# EAGLE design monostable (EAGLE 7.5.0)
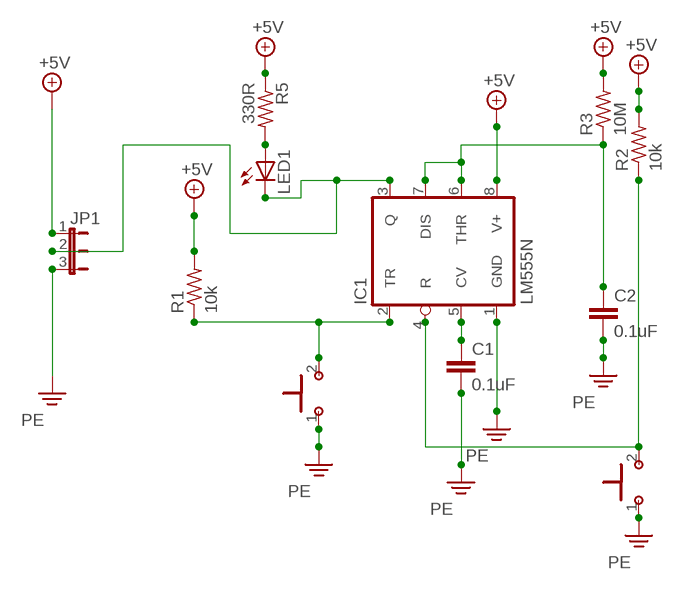
[diagram p0: schematic, sheet 1]

## Parts
C1  0.1uF  C-EU075-032X103  [C075-032X103]
C2  0.1uF  C-EU075-032X103  [C075-032X103]
IC1  LM555N  [DIL08]
JP1  JP2E  [JP2]
LED1  LED5MM  [LED5MM]
R1  10k  R-US_0207/10  [0207/10]
R2  10k  R-US_0207/10  [0207/10]
R3  10M  R-US_0207/10  [0207/10]
R5  330R  R-US_0207/10  [0207/10]
U$1  PUSHBUTTON  [PUSHBUTTON]
U$2  PUSHBUTTON  [PUSHBUTTON]

## Nets
+5V: IC1.8(V+) JP1.1 R1.2 R2.2 R3.2 R5.1
N$1: IC1.2(TR) R1.1 U$1.2
N$2: IC1.4(R) R2.1 U$2.2
N$3: C1.1 IC1.5(CV)
N$4: C2.1 IC1.6(THR) IC1.7(DIS) R3.1
N$5: IC1.3(Q) JP1.2 LED1.K(C)
N$6: LED1.A R5.2
PE: C1.2 C2.2 IC1.1(GND) JP1.3 U$1.1 U$2.1

## Library data of the parts
C1 C2 = rcl:C-EU: CAPACITOR, European symbol
IC1 = linear:*555: TIMER
JP1 = jumper:JP2E: JUMPER
LED1 = led:LED: LED OSRAM: - CHIPLED LG R971, LG N971, LY N971, LG Q971, LY Q971, LO R971, LY R971 LH N974, LH R974 LS Q976, LO Q976, LY Q976 LO Q996 - Hyper CHIPLED LW Q18S LB Q993, LB Q99A, LB R99A - SideLED LS A670, LO A670, LY A670, LG A670, LP A670 LB A673, LV A673, LT A673, LW A673 LH A674 LY A675 LS A676, LA A676, LO A676, LY A676, LW A676 LS A679, LY A679, LG A679 - Hyper Micro SIDELED® LS Y876, LA Y876, LO Y876, LY Y876 LT Y87S - SmartLED LW L88C, LW L88S LB L89C, LB L89S, LG L890 LS L89K, LO L89K, LY L89K LS L896, LA L896, LO L896, LY L896 - TOPLED LS T670, LO T670, LY T670, LG T670, LP T670 LSG T670, LSP T670, LSY T670, LOP T670, LYG T670 LG T671, LOG T671, LSG T671 LB T673, LV T673, LT T673, LW T673 LH T674 LS T676, LA T676, LO T676, LY T676, LB T676, LH T676, LSB T676, LW T676 LB T67C, LV T67C, LT T67C, LS T67K, LO T67K, LY T67K, LW E67C LS E67B, LA E67B, LO E67B, LY E67B, LB E67C, LV E67C, LT E67C LW T67C LS T679, LY T679, LG T679 LS T770, LO T770, LY T770, LG T770, LP T770 LB T773, LV T773, LT T773, LW T773 LH T774 LS E675, LA E675, LY E675, LS T675 LS T776, LA T776, LO T776, LY T776, LB T776 LHGB T686 LT T68C, LB T68C - Hyper Mini TOPLED® LB M676 - Mini TOPLED Santana® LG M470 LS M47K, LO M47K, LY M47K Source: http://www.osram.convergy.de LUXEON: - LUMILED® LXK2-PW12-R00, LXK2-PW12-S00, LXK2-PW14-U00, LXK2-PW14-V00 LXK2-PM12-R00, LXK2-PM12-S00, LXK2-PM14-U00 LXK2-PE12-Q00, LXK2-PE12-R00, LXK2-PE12-S00, LXK2-PE14-T00, LXK2-PE14-U00 LXK2-PB12-K00, LXK2-PB12-L00, LXK2-PB12-M00, LXK2-PB14-N00, LXK2-PB14-P00, LXK2-PB14-Q00 LXK2-PR12-L00, LXK2-PR12-M00, LXK2-PR14-Q00, LXK2-PR14-R00 LXK2-PD12-Q00, LXK2-PD12-R00, LXK2-PD12-S00 LXK2-PH12-R00, LXK2-PH12-S00 LXK2-PL12-P00, LXK2-PL12-Q00, LXK2-PL12-R00 Source: www.luxeon.com KINGBRIGHT: KA-3528ASYC Source: www.kingbright.com
R1-R3 R5 = resistor:R-US_: RESISTOR, American symbol
U$1 U$2 = TEJ4M1:PUSHBUTTON

## Board
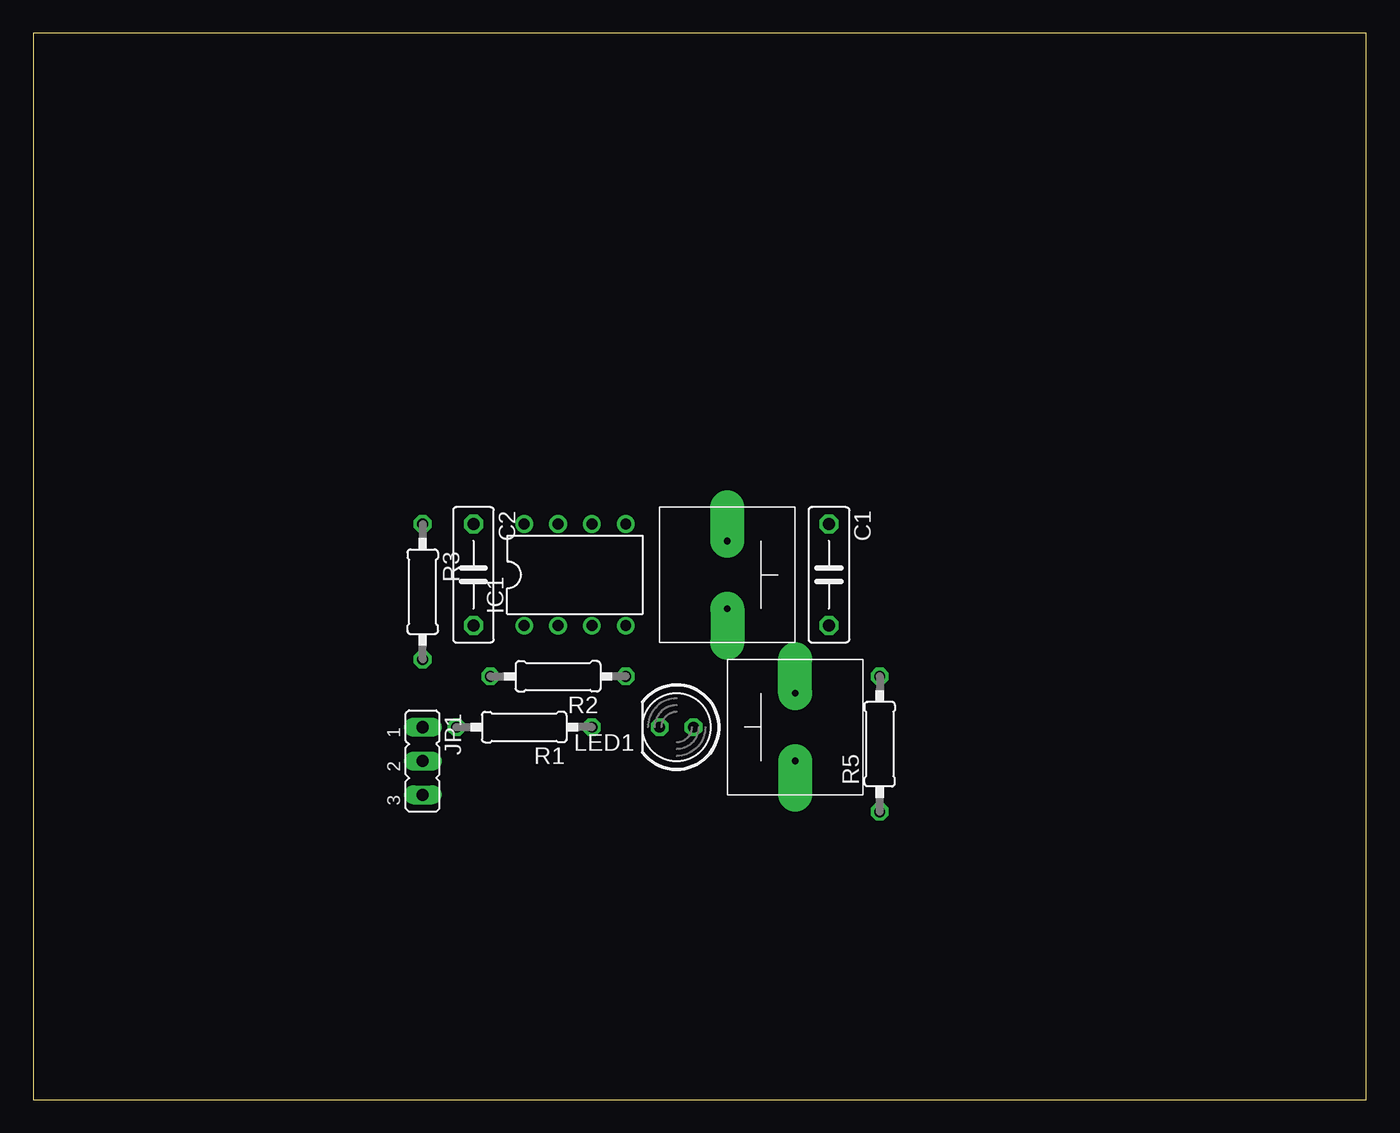
[diagram p1: board, top side]
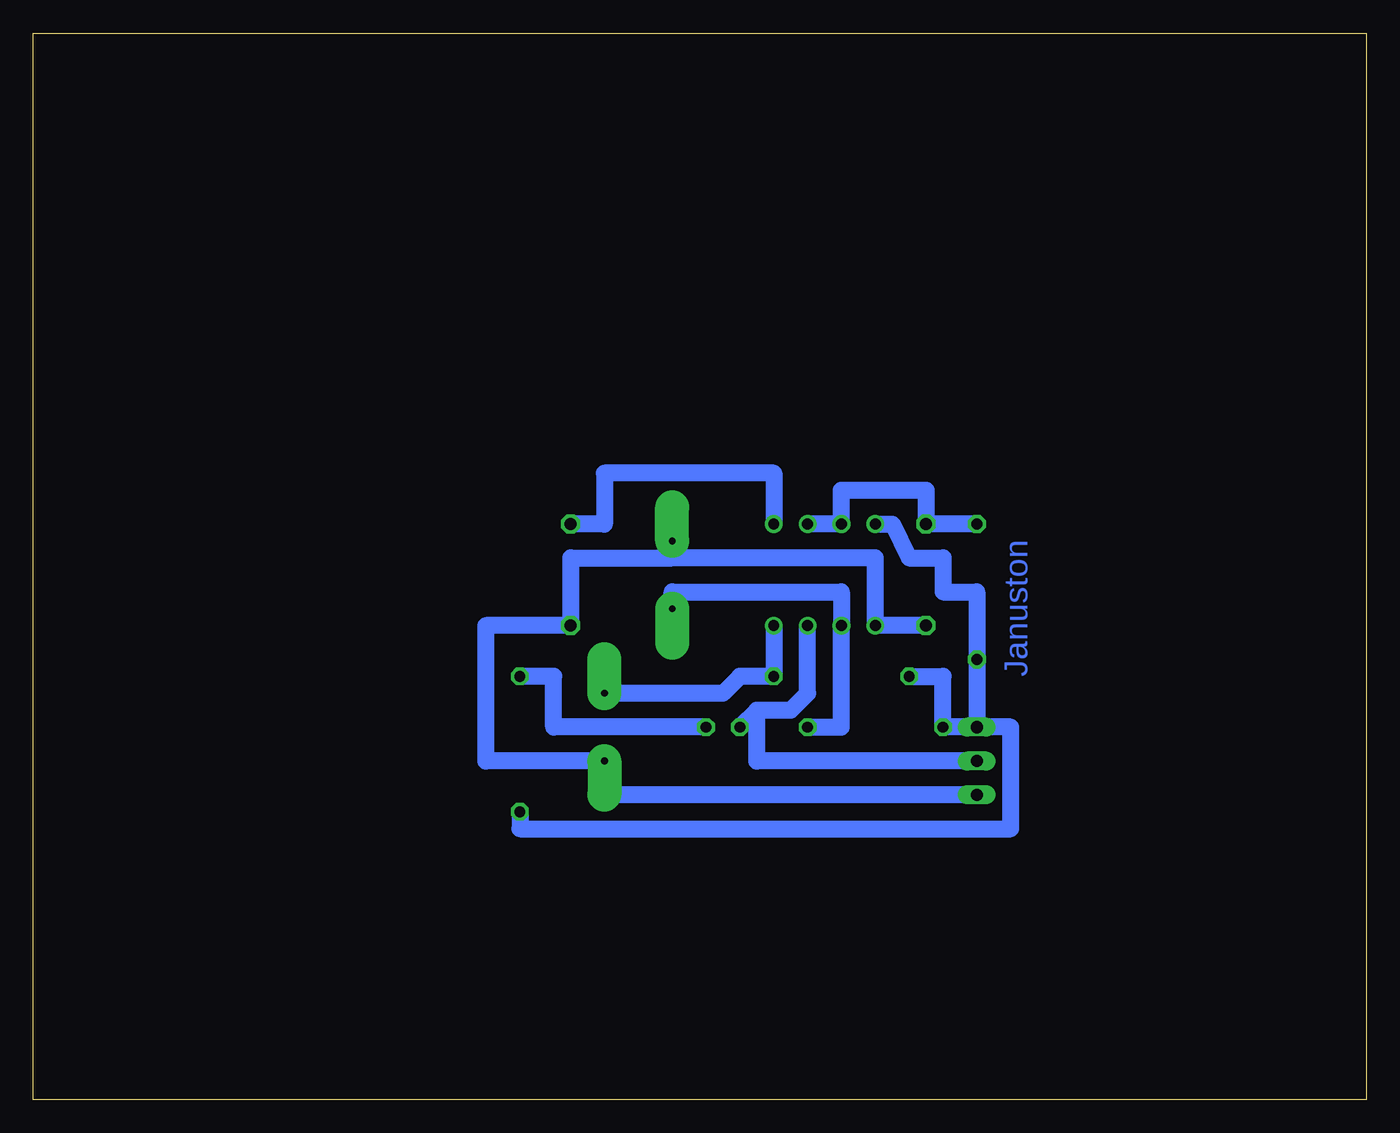
[diagram p2: board, bottom side, seen from below]

Size 100 x 80 mm. Coordinates in mm from the lower left corner, seen from the top.
Outline: 0,0 100,0 100,80 0,80 0,0
Copper layers (1*16): Top 0.035mm / dielectric 1.5mm / Bottom 0.035mm
Design rules "default": minimum track width 10mil, minimum drill 24mil, track to track 8mil, track to pad 8mil, pad to pad 8mil, via to via 8mil, smd to smd 8mil, copper to edge 40mil, drill to drill 8mil, minimum pad ring 10mil, minimum via ring 8mil, stop-mask expansion 4mil, vias tented up to drill 0mil, thermal gap 10mil

### Footprints (pad centres in the part's own frame; a part is rotated, then mirrored left to right if it is on the bottom)
C075-032X103 = drill 0.914 octagon: 1 -3.81,0; 2 3.81,0
DIL08 = drill 0.813 pad 1.27: 1 -3.81,-3.81; 2 -1.27,-3.81; 3 1.27,-3.81; 4 3.81,-3.81; 5 3.81,3.81; 6 1.27,3.81; 7 -1.27,3.81; 8 -3.81,3.81
JP2 = drill 0.914 long: 1 -2.54,0; 2 0,0; 3 2.54,0
LED5MM = drill 0.813 octagon: A -1.27,0; K 1.27,0
0207/10 = drill 0.813 octagon: 1 -5.08,0; 2 5.08,0
PUSHBUTTON = drill 0.5 pad 2.54 offset: 1 -2.54,0; 2 2.54,0

### Placement (x,y rotation side)
C1  59.69,39.37 270 top
C2  33.02,39.37 270 top
IC1  40.64,39.37 0 top
JP1  29.21,25.4 270 top
LED1  48.26,27.94 180 top
R1  36.83,27.94 180 top
R2  39.37,31.75 180 top
R3  29.21,38.1 270 top
R5  63.5,26.67 90 top
U$1  52.07,39.37 270 top
U$2  57.15,27.94 90 top

### Tracks (layer width: path | path; a pad name or v marks a point on that pad's centre or on a via)
+5V
  Bottom 1.27: R5.1 63.5,20.32 26.67,20.32 26.67,27.94 JP1.1 | JP1.1 R3.2 29.21,38.1 31.75,38.1 31.75,40.64 34.29,40.64 35.56,43.18 IC1.8 | JP1.1 R1.2 31.75,31.75 R2.2
N$1
  Bottom 1.27: U$1.2 52.07,38.1 39.37,38.1 IC1.2 39.37,27.94 R1.1
N$2
  Bottom 1.27: IC1.4 R2.1 46.99,31.75 48.26,30.48 U$2.2
N$3
  Bottom 1.27: IC1.5 44.45,46.99 57.15,46.99 57.15,43.18 C1.1
N$4
  Bottom 1.27: IC1.6 IC1.7 39.37,45.72 33.02,45.72 C2.1 R3.1
N$5
  Bottom 1.27: IC1.3 41.91,30.48 43.18,29.21 45.72,29.21 | JP1.2 45.72,25.4 45.72,29.21 | 45.72,29.21 LED1.K
N$6
  Bottom 1.27: R5.2 60.96,31.75 60.96,27.94 LED1.A
PE
  Bottom 1.27: 52.07,40.64 59.69,40.64 C1.2 66.04,35.56 66.04,25.4 U$2.1 57.15,22.86 JP1.3 | U$1.1 52.07,40.64 | C2.2 IC1.1 36.83,40.64 52.07,40.64

### Text on the board
Bottom: Januston